# Altium schematic sheet 2_Topology.SchDoc: DB_ADCS Topology
size A3; DrawnBy: Augusto Cezar Boldori Vassoler; Revision: V1.0; SheetNumber: 2; SheetTotal: 7
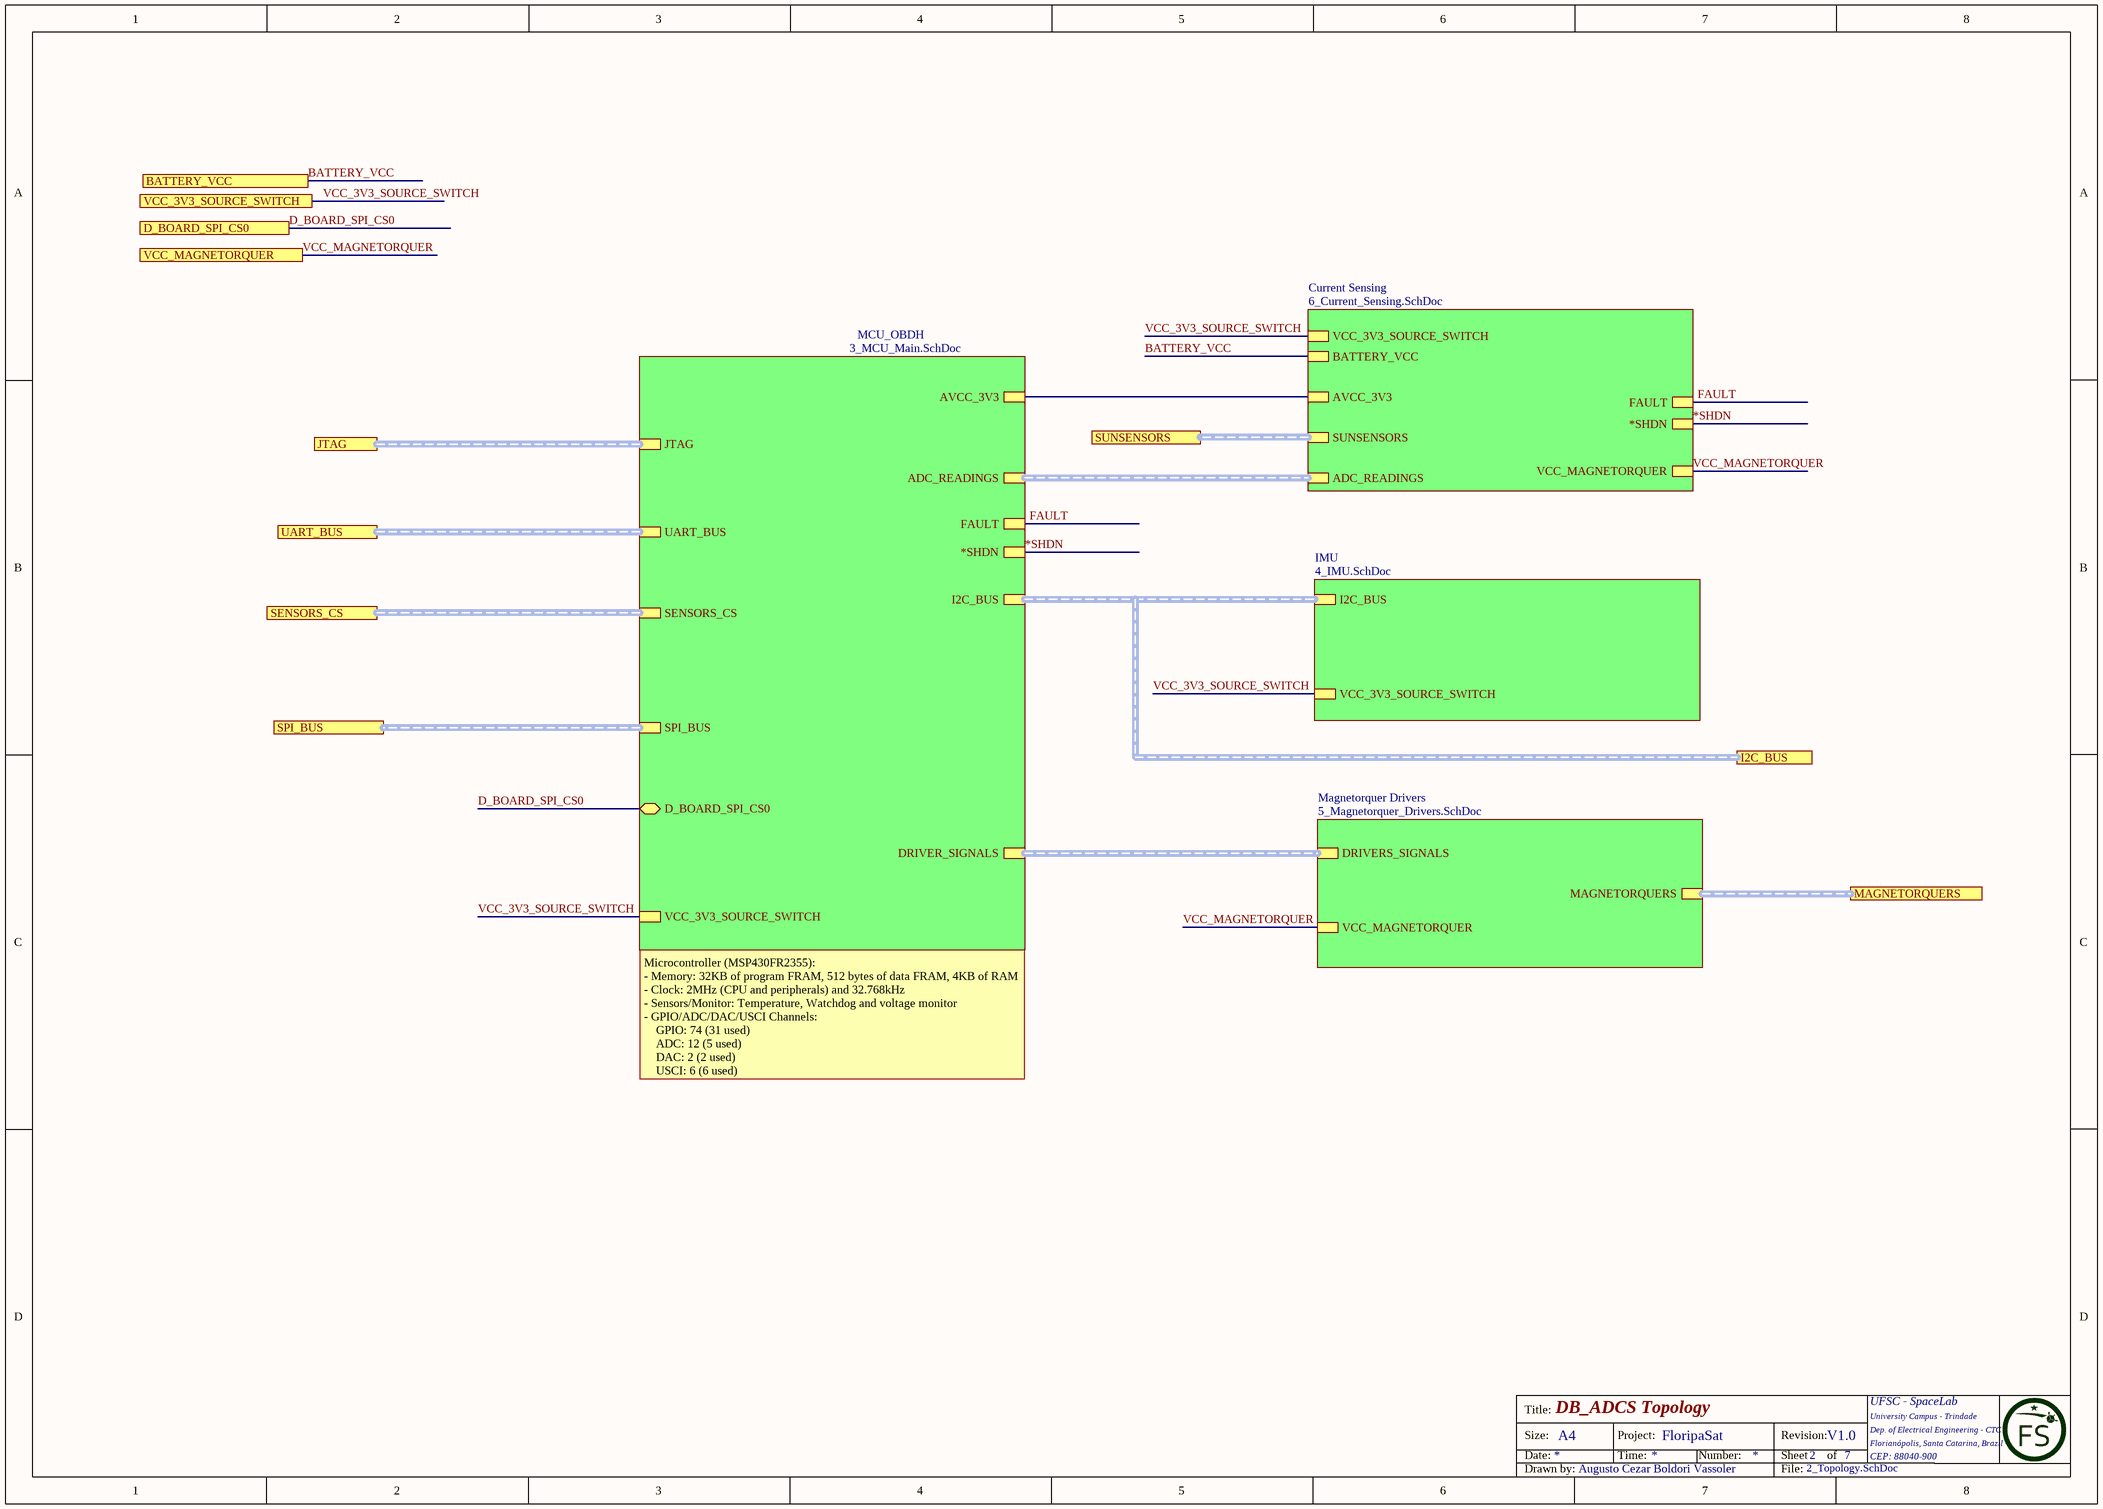
[diagram p0: 2_Topology.SchDoc]

## Sub-sheets
Current Sensing = 6_Current_Sensing.SchDoc: SUNSENSORS (harness SUNSENSORS), ADC_READINGS (harness ADC_READINGS), VCC_3V3_SOURCE_SWITCH, BATTERY_VCC, VCC_MAGNETORQUER, AVCC_3V3, *SHDN, FAULT
IMU = 4_IMU.SchDoc: I2C_BUS (harness I2C_BUS), VCC_3V3_SOURCE_SWITCH
Magnetorquer Drivers = 5_Magnetorquer_Drivers.SchDoc: MAGNETORQUERS (harness MAGNETORQUERS), DRIVERS_SIGNALS (harness DRIVER_SIGNALS), VCC_MAGNETORQUER
MCU_OBDH = 3_MCU_Main.SchDoc: JTAG (harness JTAG), UART_BUS (harness UART_BUS), SENSORS_CS (harness SENSORS_CS), DRIVER_SIGNALS (harness DRIVER_SIGNALS), SPI_BUS (harness SPI_BUS), ADC_READINGS (harness ADC_READINGS), D_BOARD_SPI_CS0 (bidir), AVCC_3V3, I2C_BUS (harness I2C_BUS), VCC_3V3_SOURCE_SWITCH, *SHDN, FAULT

## Ports
BATTERY_VCC, D_BOARD_SPI_CS0, I2C_BUS (harness I2C_BUS), JTAG (harness JTAG), MAGNETORQUERS (harness MAGNETORQUES), SENSORS_CS (harness SENSORS_CS), SPI_BUS (harness SPI_BUS), SUNSENSORS (harness SUNSENSORS), UART_BUS (harness UART_BUS), VCC_3V3_SOURCE_SWITCH, VCC_MAGNETORQUER

## Nets
*SHDN: sheet MCU_OBDH/*SHDN, sheet Current Sensing/*SHDN
BATTERY_VCC: port BATTERY_VCC, sheet Current Sensing/BATTERY_VCC
D_BOARD_SPI_CS0: port D_BOARD_SPI_CS0, sheet MCU_OBDH/D_BOARD_SPI_CS0
FAULT: sheet MCU_OBDH/FAULT, sheet Current Sensing/FAULT
VCC_3V3_SOURCE_SWITCH: port VCC_3V3_SOURCE_SWITCH, sheet MCU_OBDH/VCC_3V3_SOURCE_SWITCH, sheet Current Sensing/VCC_3V3_SOURCE_SWITCH, sheet IMU/VCC_3V3_SOURCE_SWITCH
VCC_MAGNETORQUER: port VCC_MAGNETORQUER, sheet Current Sensing/VCC_MAGNETORQUER, sheet Magnetorquer Drivers/VCC_MAGNETORQUER
(unnamed): sheet MCU_OBDH/AVCC_3V3, sheet Current Sensing/AVCC_3V3

## Buses and harness runs
harness port I2C_BUS = sheet IMU/I2C_BUS = sheet MCU_OBDH/I2C_BUS
harness port JTAG = sheet MCU_OBDH/JTAG
harness port MAGNETORQUERS = sheet Magnetorquer Drivers/MAGNETORQUERS
harness port SENSORS_CS = sheet MCU_OBDH/SENSORS_CS
harness port SPI_BUS = sheet MCU_OBDH/SPI_BUS
harness port SUNSENSORS = sheet Current Sensing/SUNSENSORS
harness port UART_BUS = sheet MCU_OBDH/UART_BUS
harness sheet Current Sensing/ADC_READINGS = sheet MCU_OBDH/ADC_READINGS
harness sheet Magnetorquer Drivers/DRIVERS_SIGNALS = sheet MCU_OBDH/DRIVER_SIGNALS

## Notes on the sheet
- Microcontroller (MSP430FR2355):
  - Memory: 32KB of program FRAM, 512 bytes of data FRAM, 4KB of RAM
  - Clock: 2MHz (CPU and peripherals) and 32.768kHz
  - Sensors/Monitor: Temperature, Watchdog and voltage monitor
  - GPIO/ADC/DAC/USCI Channels:
  GPIO: 74 (31 used)
  ADC: 12 (5 used)
  DAC: 2 (2 used)
  USCI: 6 (6 used)
- Title:
- Size:
- Date:
- A4
- Project:
- Time:
- FloripaSat
- Number:
- Revision:
- Sheet
- of
- UFSC - SpaceLab
- University Campus - Trindade
- Dep. of Electrical Engineering - CTC
- Florianópolis, Santa Catarina, Brazil
- CEP: 88040-900
- Drawn by:
- File: